# EAGLE design nanoMoCo (EAGLE 6.1)
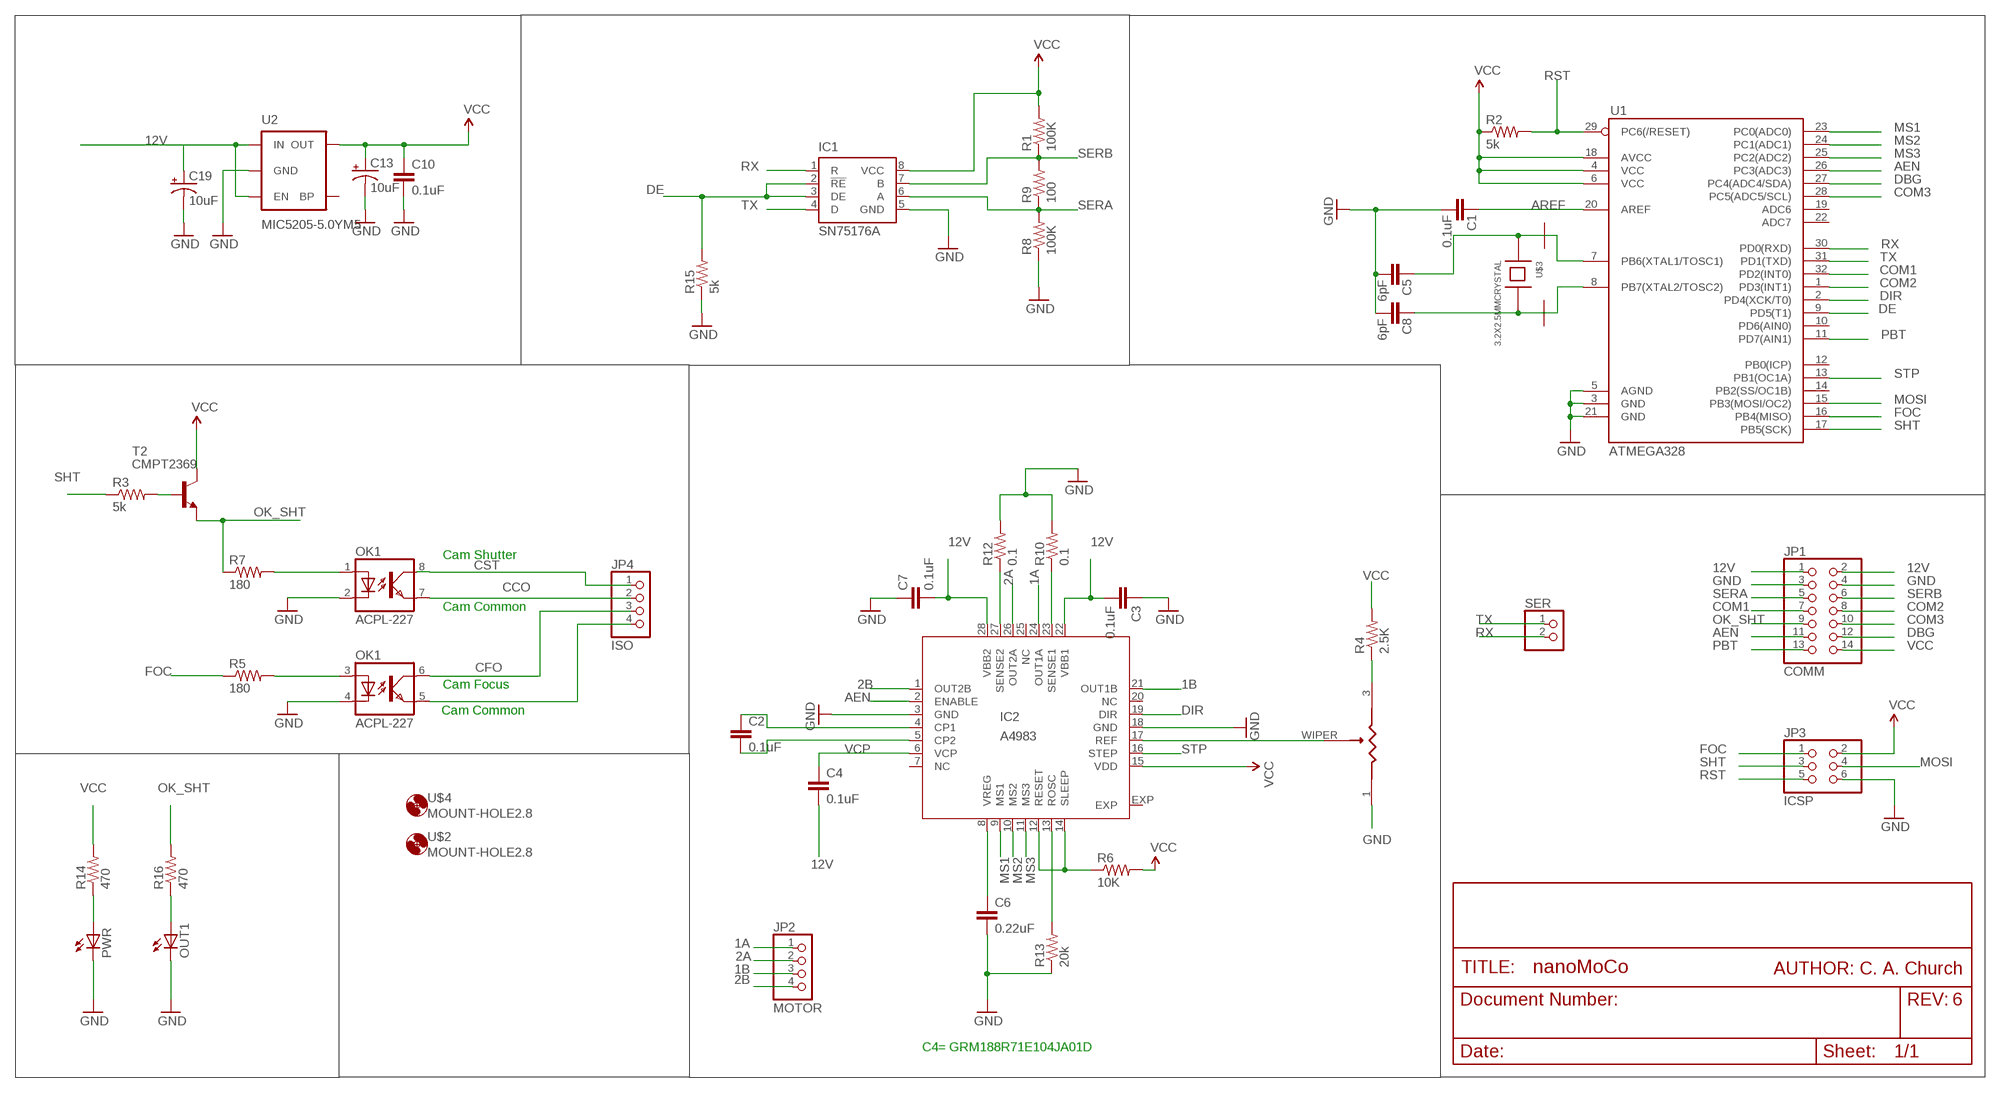
[diagram p0: schematic, sheet 1]

## Parts
C1  0.1uF  CAP0402  [C0402]
C2  0.1uF  C-EUC1608  [C1608]
C3  0.1uF  C-EUC1608  [C1608]
C4  0.1uF  C-EUC1608  [C1608]
C5  6pF  CAP0402  [C0402]
C6  0.22uF  C-EUC0805  [C0805]
C7  0.1uF  C-EUC1608  [C1608]
C8  6pF  CAP0402  [C0402]
C10  0.1uF  CAP0402  [C0402]
C13  10uF  CAP_POL1206  [EIA3216]
C19  10uF  CAP_POL1206  [EIA3216]
IC1  SN75176A  SN65176D  [SO-08]
IC2  A4983  [QFN28ET]
JP1  COMM  PINHD-2X7  [2X07]
JP2  MOTOR  PINHD-1X4  [1X04]
JP3  ICSP  PINHD-2X3  [2X03]
JP4  ISO  PINHD-1X4  [1X04]
OK1  ACPL-227  [SOIC8]
OUT1  LEDCHIPLED_0603  [CHIPLED_0603]
PWR  LEDCHIPLED_0603  [CHIPLED_0603]
R1  100K  RESISTOR0402  [C0402]
R2  5k  RESISTOR0402  [C0402]
R3  5k  RESISTOR0402  [C0402]
R4  2.5K  RESISTOR0402  [C0402]
R5  180  RESISTOR0402  [C0402]
R6  10K  RESISTOR0402  [C0402]
R7  180  RESISTOR0402  [C0402]
R8  100K  RESISTOR0402  [C0402]
R9  100  RESISTOR0402  [C0402]
R10  0.1  R-US_R0603  [R0603]
R12  0.1  R-US_R0603  [R0603]
R13  20k  RESISTOR0402  [C0402]
R14  470  RESISTOR0402  [C0402]
R15  5k  RESISTOR0402  [C0402]
R16  470  RESISTOR0402  [C0402]
SER  PINHD-1X2  [1X02]
T2  CMPT2369  BCW60-NPN-SOT23-BEC  [SOT23-BEC]
U1  ATMEGA328  ATMEGA168  [TQFP32-08]
U2  MIC5205-5.0YM5  V_REG_LDOSMD  [SOT23-5]
U$1  CADJ  TC33X-2  [3MMSMD]
U$2  MOUNT-HOLE2.8  [2,8]
U$3  3.2X2.5MMCRYSTAL  [3.2X2.5MM]
U$4  MOUNT-HOLE2.8  [2,8]

## Nets
1A: IC2.24(OUT1A) JP2.1
1B: IC2.21(OUT1B) JP2.3
2A: IC2.26(OUT2A) JP2.2
2B: IC2.1(OUT2B) JP2.4
3.3V: IC1.8(VCC) R1.2 ; supply symbol labelled VCC
12V [vcc]: C3.2 C4.2 C7.2 C19.A(+) IC2.22(VBB1) IC2.28(VBB2) JP1.1 JP1.2 U2.1(IN) U2.3(EN)
AEN: IC2.2(ENABLE) JP1.11 U1.26(PC3(ADC3))
AREF: C1.2 U1.20(AREF)
ARST: IC2.12(RESET) IC2.14(SLEEP) R6.1
CCO: JP4.2 OK1.7(EMIT)
CFO: JP4.3 OK1.6(COL1)
COM1: JP1.7 U1.32(PD2(INT0))
COM2: JP1.8 U1.1(PD3(INT1))
COM3: JP1.10 U1.28(PC5(ADC5/SCL))
CST: JP4.1 OK1.8(COL)
DBG: JP1.12 U1.27(PC4(ADC4/SDA))
DE: IC1.2(!RE) IC1.3(DE) R15.2 U1.9(PD5(T1))
DIR: IC2.19(DIR) U1.2(PD4(XCK/T0))
FOC: JP3.1 R5.1 U1.16(PB4(MISO))
GND: C1.1 C3.1 C5.1 C6.2 C7.1 C8.1 C10.2 C13.C(-) C19.C(-) IC1.5(GND) IC2.3(GND) IC2.18(GND) JP1.3 JP1.4 JP3.6 OK1.2(C) OK1.4(C1) OUT1.C PWR.C R8.1 R10.2 R12.2 R13.1 R15.1 U1.3(GND) U1.5(AGND) U1.21(GND) U2.2(GND) U$1.1
MOSI: JP3.4 U1.15(PB3(MOSI/OC2))
MS1: IC2.9(MS1) U1.23(PC0(ADC0))
MS2: IC2.10(MS2) U1.24(PC1(ADC1))
MS3: IC2.11(MS3) U1.25(PC2(ADC2))
N$1: R4.1 U$1.3
N$2: PWR.A R14.1
N$3: OUT1.A R16.1
N$4: C2.1 IC2.4(CP1)
N$5: C2.2 IC2.5(CP2)
N$6: JP4.4 OK1.5(EMIT1)
N$7: OK1.1(A) R7.2
N$8: OK1.3(A1) R5.2
N$11: IC2.17(REF) U$1.WIPER
N$14: IC2.23(SENSE1) R10.1
N$15: IC2.27(SENSE2) R12.1
N$25: R3.2 T2.B
OK_SHT: JP1.9 R7.1 R16.2 T2.E
PBT: JP1.13 U1.11(PD7(AIN1))
ROSC: IC2.13(ROSC) R13.2
RST: JP3.5 R2.2 U1.29(PC6(/RESET))
RX: IC1.1(R) SER.2 U1.30(PD0(RXD))
SERA: IC1.6(A) JP1.5 R8.2 R9.1
SERB: IC1.7(B) JP1.6 R1.1 R9.2
SHT: JP3.3 R3.1 U1.17(PB5(SCK))
STP: IC2.16(STEP) U1.13(PB1(OC1A))
TX: IC1.4(D) SER.1 U1.31(PD1(TXD))
VCC: C10.1 C13.A(+) IC2.15(VDD) JP1.14 JP3.2 R2.1 R4.2 R6.2 R14.2 T2.C U1.4(VCC) U1.6(VCC) U1.18(AVCC) U2.5(OUT)
VCP: C4.1 IC2.6(VCP)
VREG: C6.1 IC2.8(VREG)
XTAL1: C5.2 U1.7(PB6(XTAL1/TOSC1)) U$3.1
XTAL2: C8.2 U1.8(PB7(XTAL2/TOSC2)) U$3.3
Unconnected: IC2.7(NC) IC2.20(NC) IC2.25(NC) IC2.EXP U1.10(PD6(AIN0)) U1.12(PB0(ICP)) U1.14(PB2(SS/OC1B)) U1.19(ADC6) U1.22(ADC7) U2.4(BP)

## Notes on the sheet
- Cam Shutter
- Cam Common
- Cam Focus
- Cam Common
- AUTHOR: C. A. Church
- 6
- C4= GRM188R71E104JA01D

## Power pins joined to a net without a drawn wire
4: U$3.4
GND: U$3.2(GND)

## Library data of the parts
C1 C5 C8 C10 = SparkFun:CAP: Capacitor Standard 0603 ceramic capacitor, and 0.1" leaded capacitor.
C2-C4 C6 C7 = rcl:C-EU: CAPACITOR, European symbol
C13 C19 = SparkFun:CAP_POL: Capacitor Polarized These are standard SMD and PTH capacitors. Normally 10uF, 47uF, and 100uF in electrolytic and tantalum varieties. Always verify the external diameter of the through hole cap, it varies with capacity, voltage, and manufacturer. The EIA devices should be standard.
IC1 = texas:SN65176: DIFFERENTIAL BUS TRANSCEIVER Source: http://focus.ti.com .. sn65176b.pdf
IC2 = allegro:A4983: DMOS Microstepping Driver with Translator Auto generated by make-symbol-device-package-bsdl.ulp Rev. 32 Source: http://www.allegromicro.com/en/Products/Part_Numbers/4983/4983.pdf
JP1 = pinhead:PINHD-2X7: PIN HEADER
JP2 JP4 = pinhead:PINHD-1X4: PIN HEADER
JP3 = pinhead:PINHD-2X3: PIN HEADER
OK1 = avago-opto:ACPL-227: ACPL-227 Dual optocoupler SOIC8
OUT1 PWR = led:LED: LED OSRAM: - CHIPLED LG R971, LG N971, LY N971, LG Q971, LY Q971, LO R971, LY R971 LH N974, LH R974 LS Q976, LO Q976, LY Q976 LO Q996 - Hyper CHIPLED LW Q18S LB Q993, LB Q99A, LB R99A - SideLED LS A670, LO A670, LY A670, LG A670, LP A670 LB A673, LV A673, LT A673, LW A673 LH A674 LY A675 LS A676, LA A676, LO A676, LY A676, LW A676 LS A679, LY A679, LG A679 - Hyper Micro SIDELED® LS Y876, LA Y876, LO Y876, LY Y876 LT Y87S - SmartLED LW L88C, LW L88S LB L89C, LB L89S, LG L890 LS L89K, LO L89K, LY L89K LS L896, LA L896, LO L896, LY L896 - TOPLED LS T670, LO T670, LY T670, LG T670, LP T670 LSG T670, LSP T670, LSY T670, LOP T670, LYG T670 LG T671, LOG T671, LSG T671 LB T673, LV T673, LT T673, LW T673 LH T674 LS T676, LA T676, LO T676, LY T676, LB T676, LH T676, LSB T676, LW T676 LB T67C, LV T67C, LT T67C, LS T67K, LO T67K, LY T67K, LW E67C LS E67B, LA E67B, LO E67B, LY E67B, LB E67C, LV E67C, LT E67C LW T67C LS T679, LY T679, LG T679 LS T770, LO T770, LY T770, LG T770, LP T770 LB T773, LV T773, LT T773, LW T773 LH T774 LS E675, LA E675, LY E675, LS T675 LS T776, LA T776, LO T776, LY T776, LB T776 LHGB T686 LT T68C, LB T68C - Hyper Mini TOPLED® LB M676 - Mini TOPLED Santana® LG M470 LS M47K, LO M47K, LY M47K Source: http://www.osram.convergy.de LUXEON: - LUMILED® LXK2-PW12-R00, LXK2-PW12-S00, LXK2-PW14-U00, LXK2-PW14-V00 LXK2-PM12-R00, LXK2-PM12-S00, LXK2-PM14-U00 LXK2-PE12-Q00, LXK2-PE12-R00, LXK2-PE12-S00, LXK2-PE14-T00, LXK2-PE14-U00 LXK2-PB12-K00, LXK2-PB12-L00, LXK2-PB12-M00, LXK2-PB14-N00, LXK2-PB14-P00, LXK2-PB14-Q00 LXK2-PR12-L00, LXK2-PR12-M00, LXK2-PR14-Q00, LXK2-PR14-R00 LXK2-PD12-Q00, LXK2-PD12-R00, LXK2-PD12-S00 LXK2-PH12-R00, LXK2-PH12-S00 LXK2-PL12-P00, LXK2-PL12-Q00, LXK2-PL12-R00 Source: www.luxeon.com KINGBRIGHT: KA-3528ASYC Source: www.kingbright.com
R1-R9 R13-R16 = SparkFun:RESISTOR: Resistor Basic schematic elements and footprints for 0603, 1206, and PTH 1/10th watt (small) resistors.
R10 R12 = resistor:R-US_: RESISTOR, American symbol
SER = pinhead:PINHD-1X2: PIN HEADER
T2 = transistor:*-NPN-: NPN Transistror BF959 corrected 2008.03.06
U1 = SparkFun:ATMEGA168
U2 = SparkFun:V_REG_LDO: Voltage Regulator LDO Standard 150mA LDO voltage regulator in SOT-23 layout. Micrel part MIC5205. BP (by-pass) pin is used to lower output noise with 470pF cap.
U$1 = bourns trimpot:TC33X-2: Bourns TC33X-2 SMD Trimmer Potentiometer
U$2 U$4 = holes:MOUNT-HOLE: MOUNTING HOLE with drill center marker
U$3 = kyocera-crystals:3.2X2.5MMCRYSTAL: Kyocera 3.2x2.5 Mobile Crystal

## Net classes
1 vcc: width 0.254 mm

## Board
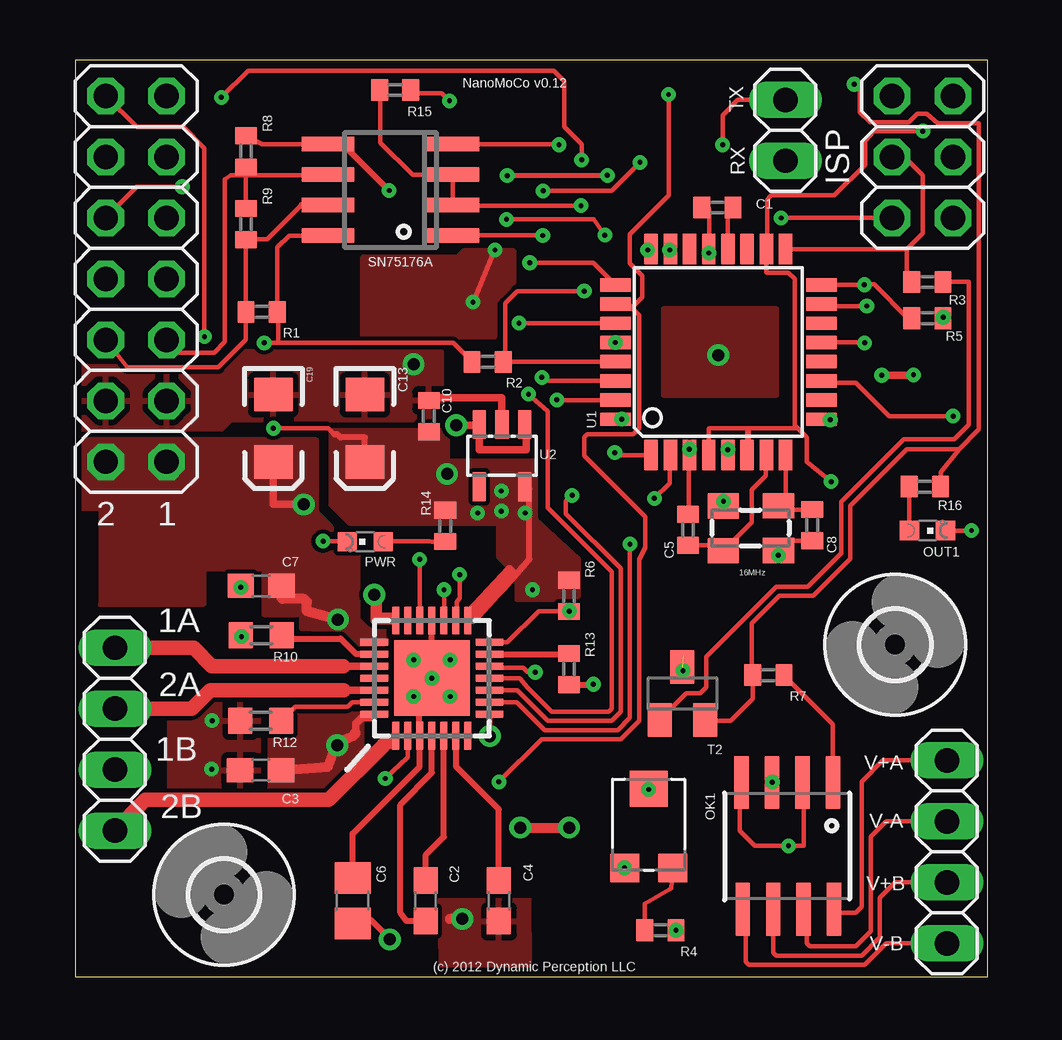
[diagram p1: board, top side]
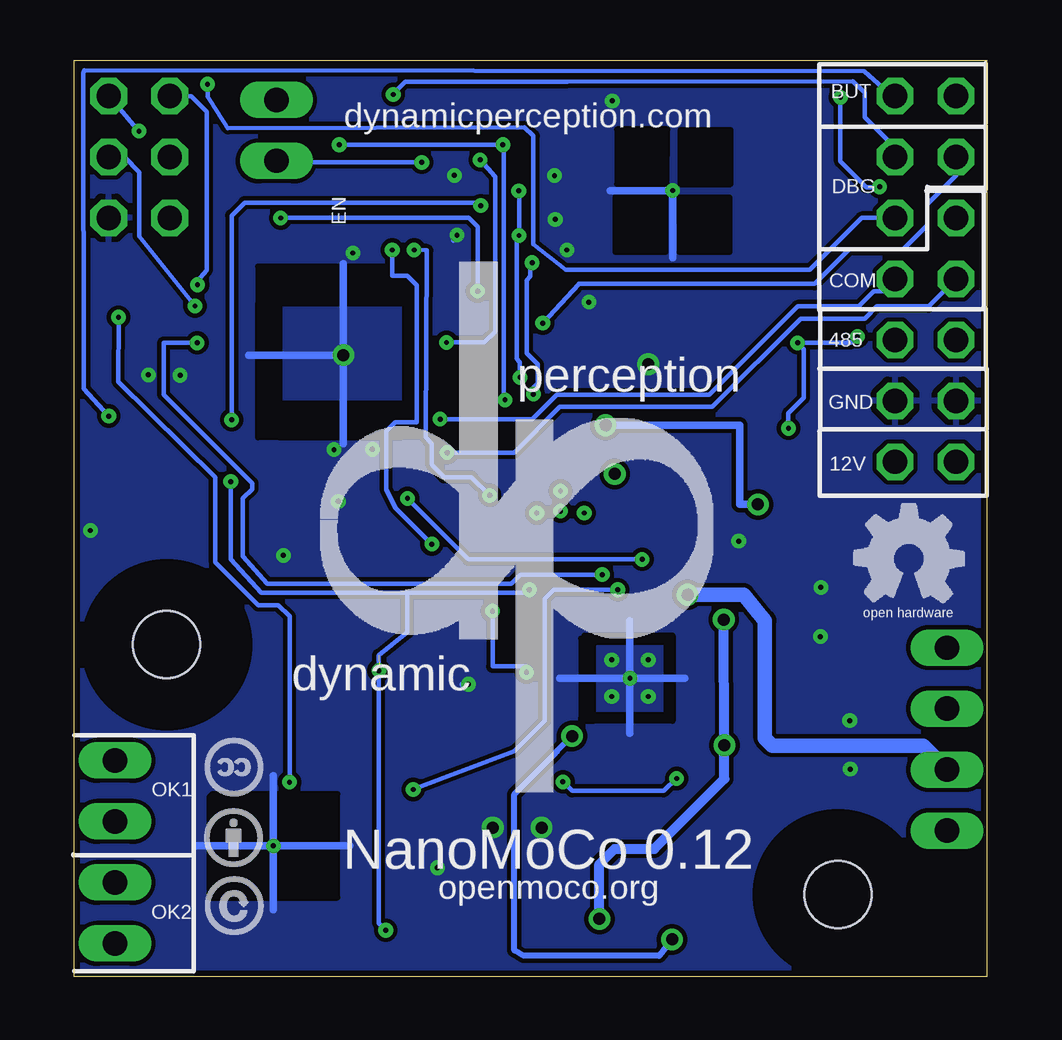
[diagram p2: board, bottom side, seen from below]

Size 38.02 x 38.2 mm. Coordinates in mm from the lower left corner, seen from the top.
Outline: 0,0 38.02,0 38.02,38.2 0,38.2 0,0
Copper layers (1*16): Top 0.035mm / dielectric 1.5mm / Bottom 0.035mm
Design rules: minimum track width 7mil, minimum drill 8mil, track to track 7mil, track to pad 7mil, pad to pad 7mil, via to via 7mil, smd to smd 7mil, copper to edge 10mil, drill to drill 8mil, minimum pad ring 10mil, minimum via ring 8mil, stop-mask expansion 4mil, vias tented up to drill 25mil, thermal gap 10mil
bRestrict: area 13.1,10.8 to 13.3,14.2; area 13.5,14 to 16.8,14.2; area 16.4,10.7 to 16.9,14.1; area 13.1,10.7 to 16.4,10.9; area 23.2,22.5 to 24.3,29.6; area 24.3,28.1 to 30.4,29.6; area 29.5,22.5 to 30.4,27.9; area 24.4,22.5 to 29.3,23.9; area 27.1,3.3 to 32.4,7.6; area 10.7,33 to 12.8,35.3; area 13.3,33 to 15.4,35.3; area 10.7,30.2 to 12.8,32.5; 1 more areas

### Footprints (pad centres in the part's own frame; a part is rotated, then mirrored left to right if it is on the bottom)
C0402 = smd 0.7 x 0.9: 1 -0.65,0; 2 0.65,0
C1608 = smd 1.1 x 1: 1 -0.85,0; 2 0.85,0
C0805 = smd 1.3 x 1.5: 1 -0.95,0; 2 0.95,0
EIA3216 = smd 1.4 x 1.6: A 1.4,0; C -1.4,0
SO-08 = smd 0.6 x 2.2: 1 -1.905,-2.6; 2 -0.635,-2.6; 3 0.635,-2.6; 4 1.905,-2.6; 5 1.905,2.6; 6 0.635,2.6; 7 -0.635,2.6; 8 -1.905,2.6
QFN28ET = smd 1.15 x 0.3: 1 -2.4,1.5; 2 -2.4,1; 3 -2.4,0.5; 4 -2.4,0; 5 -2.4,-0.5; 6 -2.4,-1; 7 -2.4,-1.5; 15 2.4,-1.5; 16 2.4,-1; 17 2.4,-0.5; 18 2.4,0; 19 2.4,0.5; 20 2.4,1; 21 2.4,1.5 | smd 0.3 x 1.15: 8 -1.5,-2.4; 9 -1,-2.4; 10 -0.5,-2.4; 11 0,-2.4; 12 0.5,-2.4; 13 1,-2.4; 14 1.5,-2.4; 22 1.5,2.4; 23 1,2.4; 24 0.5,2.4; 25 0,2.4; 26 -0.5,2.4; 27 -1,2.4; 28 -1.5,2.4 | smd 3.15 x 3.15: EXP 0,0
2X07 = drill 1.016 octagon: 1 -7.62,-1.27; 2 -7.62,1.27; 3 -5.08,-1.27; 4 -5.08,1.27; 5 -2.54,-1.27; 6 -2.54,1.27; 7 0,-1.27; 8 0,1.27; 9 2.54,-1.27; 10 2.54,1.27; 11 5.08,-1.27; 12 5.08,1.27; 13 7.62,-1.27; 14 7.62,1.27
1X04 = drill 1.016 long: 1 -3.81,0; 2 -1.27,0; 3 1.27,0; 4 3.81,0
2X03 = drill 1.016 octagon: 1 -2.54,-1.27; 2 -2.54,1.27; 3 0,-1.27; 4 0,1.27; 5 2.54,-1.27; 6 2.54,1.27
SOIC8 = smd 2.2 x 0.6: 1 0,3.81; 2 0,2.54; 3 0,1.27; 4 0,0; 5 5.28,0.05; 6 5.28,1.32; 7 5.28,2.59; 8 5.28,3.86
CHIPLED_0603 = smd 0.8 x 0.8: A 0,-0.75; C 0,0.75
R0603 = smd 1 x 1.1: 1 -0.85,0; 2 0.85,0
1X02 = drill 1.016 long: 1 -1.27,0; 2 1.27,0
SOT23-BEC = smd 1 x 1.4: B -0.95,-1.1; C 0,1.1; E 0.95,-1.1
TQFP32-08 = smd 1.27 x 0.559: 1 -4.293,2.8; 2 -4.293,2; 3 -4.293,1.2; 4 -4.293,0.4; 5 -4.293,-0.4; 6 -4.293,-1.2; 7 -4.293,-2; 8 -4.293,-2.8; 17 4.293,-2.8; 18 4.293,-2; 19 4.293,-1.2; 20 4.293,-0.4; 21 4.293,0.4; 22 4.293,1.2; 23 4.293,2; 24 4.293,2.8 | smd 0.559 x 1.27: 9 -2.8,-4.293; 10 -2,-4.293; 11 -1.2,-4.293; 12 -0.4,-4.293; 13 0.4,-4.293; 14 1.2,-4.293; 15 2,-4.293; 16 2.8,-4.293; 25 2.8,4.293; 26 2,4.293; 27 1.2,4.293; 28 0.4,4.293; 29 -0.4,4.293; 30 -1.2,4.293; 31 -2,4.293; 32 -2.8,4.293
SOT23-5 = smd 0.55 x 1.2: 1 -0.95,-1.3; 2 0,-1.3; 3 0.95,-1.3; 4 0.95,1.3; 5 -0.95,1.3
3MMSMD = smd 1.2 x 1.2: 1 -0.6,0.6; 3 1.4,0.6 | smd 1.6 x 1.5: WIPER 0.4,3.9
2,8 = hole 2.8: 0,0
3.2X2.5MM = smd 1.3 x 1.05: 1 0.635,0; 2 2.935,0.01; 3 2.935,1.875; 4 0.635,1.865

### Placement (x,y rotation side)
C1  26.76,32.05 0 top
C2  14.61,3.17 90 top
C3  7.72,8.62 0 top
C4  17.65,3.17 270 top
C5  25.53,18.63 270 top
C6  11.56,3.17 90 top
C7  7.75,16.29 0 top
C8  30.71,18.82 90 top
C10  14.73,23.37 90 top
C13  12.06,22.86 270 top
C19  8.26,22.86 270 top
IC1  13.13,32.79 90 top
IC2  14.86,12.45 90 top
JP1  2.54,29.08 90 top
JP2  1.65,9.91 270 top
JP3  35.31,34.16 270 top
JP4  36.32,5.21 270 top
OK1  27.76,8.1 270 top
OUT1  35.51,18.6 270 top
PWR  12.08,18.14 90 top
R1  7.77,27.71 0 top
R2  17.18,25.63 0 top
R3  35.51,28.96 0 top
R4  24.38,1.94 0 top
R5  35.51,27.44 0 top
R6  20.57,15.88 90 top
R7  28.88,12.57 0 top
R8  7.11,34.4 270 top
R9  7.11,31.37 270 top
R10  7.75,14.24 180 top
R12  7.73,10.67 180 top
R13  20.57,12.83 90 top
R14  15.42,18.79 90 top
R15  13.34,36.96 180 top
R16  35.4,20.43 0 top
SER  29.59,35.27 270 top
T2  25.3,11.81 0 top
U1  26.8,26.04 90 top
U2  17.78,21.72 180 top
U$1  23.5,3.94 0 top
U$2  6.2,3.43 270 top
U$3  26.37,17.75 0 top
U$4  34.16,13.84 0 top

### Tracks (layer width: path | path; a pad name or v marks a point on that pad's centre or on a via)
1A
  Top 0.305: 11.18,12.95 IC2.24
  Top 0.61: 11.18,12.95 5.69,12.95 4.93,13.72 JP2.1
1B  (via drill 0.5 pad 0.25)
  Top 0.305: IC2.21 12.46,14.85 v12.46,15.93
  Bottom 0.61: v12.46,15.93 10.12,15.93 9.24,14.84 9.24,9.95 8.92,9.63 2.65,9.63 JP2.3
2A
  Top 0.305: IC2.26 11.18,11.95 10.66,11.95
  Top 0.61: JP2.2 4.86,11.18 5.63,11.94 11.18,11.94 11.18,11.95
2B
  Top 0.25: 13.33,9.79 13.33,10.02 IC2.1
  Top 0.305: IC2.1 13.36,9.68 13.34,9.65 12.83,9.65 | 12.79,9.79 13.33,9.79 13.33,9.8
  Top 0.61: 12.83,9.65 12.83,9.64 10.56,7.37 2.93,7.37 JP2.4
3.3V
  Top 0.178: IC1.8 8.91,30.89 8.43,30.4 8.43,27.72
  Top 0.254: 8.43,27.72 R1.2
12V  (via drill 0.5 pad 0.25)
  Top 0.305: U2.1 18.8,23.02 18.8,21.97 16.83,21.97 U2.3 16.83,22.99 v15.88,22.99 | C19.A 8.26,19.68 v9.53,19.68 | 11.68,10.17 11.68,10.54 11.94,10.79 12.31,10.79 IC2.28 | v10.95,14.89 v10.95,14.9
  Top 0.406: C7.2 8.6,15.79 8.64,15.75 9.53,15.75 9.65,15.62 9.65,15.24 v10.95,14.89 | 11.56,10.03 10.92,9.78 10.54,8.76 C3.2 | 11.56,10.03 11.56,10.04 | 11.56,10.03 11.57,10.03 11.68,10.17 | v16.13,2.41 15.62,2.41
  Bottom 0.305: v9.53,19.68 10.29,19.68 10.29,22.99 v15.88,22.99
  Bottom 0.406: v10.95,14.89 v10.92,9.65 10.92,8.26 13.84,5.33 15.49,5.33 16.13,4.7 v16.13,2.41
  pour Top (isolate 0.178, no thermals): 0,22.23 0,19.56 7.75,19.56 7.87,19.43 7.87,15.11 9.27,15.11 10.03,15.88 10.03,22.35 0.13,22.35
  pour Top: 15.21,3.2 15.24,0.51 18.91,0.53 18.9,3.17 15.44,3.15 15.29,3.17
  pour Top (no thermals): 8.13,10.92 8.13,7.49 10.54,7.49 11.94,8.89 11.94,10.92
  pour Top (no thermals): 9.41,15.11 9.41,14.52 9.42,14.5 9.86,14.5 10.5,13.86 12.88,13.86 12.88,14.49 12.87,14.5 12.19,14.5 11.8,14.9 11.8,17.61 9.54,19.88 9.54,15.24
  pour Top (no thermals): 1.07,19.55 1.07,15.54 1.03,15.51 5.33,15.51 5.37,15.54 5.37,16.95 5.33,16.99 7.89,16.99 7.92,17.03 7.92,19.55 7.89,19.58 1.1,19.58
AEN  (via drill 0.2, 0.2 pad 0.25)
  Top 0.178: IC2.2 13.86,9.16 v12.92,8.27 | v17.65,8.13 19.43,9.91 22.73,9.91 23.5,10.67 23.5,17.39 23.75,17.91 23.75,19.18 21.21,21.72 21.21,22.48 21.34,22.61 23.24,22.61 23.5,22.86 23.5,27.56 23.18,27.88 23.62,28.32 23.62,29.22 23.1,29.74 23.1,30.94 24.72,32.56 v24.72,36.77
  Top 0.254: 23.18,27.88 23.02,28.04 | 23.02,28.04 U1.26 | 23.02,28.04 22.92,27.94 22.86,27.94
  Bottom 0.178: v12.92,8.27 13.46,7.75 17.27,7.75 v17.65,8.13 | JP1.11 3.81,34.54 5.08,35.81 5.08,36.83 5.58,37.33 17.45,37.3 19.48,37.3 19.49,37.31 24.23,37.31 24.73,36.8 v24.72,36.77
AREF
  Top 0.178: U1.20 27.2,32.02 27.43,32.26 27.39,32.19
  Top 0.254: 27.39,32.19 C1.2
ARST  (via drill 0.2 pad 0.18)
  Top 0.178: IC2.14 18.01,13.95 19.3,15.24 20.3,15.24 | R6.1 v20.59,15.24 | IC2.12 17.33,12.88 18.67,12.88 18.86,12.69 v19.17,12.69
  Top 0.254: 20.3,15.24 R6.1 v20.59,15.24
  Bottom 0.178: v20.59,15.24 20.59,12.94 19.18,12.95 v19.17,12.69
CCO
  Top 0.178: 30.48,2.69 30.48,1.4 30.61,1.27 32.51,1.27 33.15,1.91 33.15,5.84 33.78,6.48 JP4.2
  Top 0.254: OK1.7 30.48,2.69
CFO
  Top 0.178: OK1.6 29.08,1.02 29.21,0.89 32.77,0.89 33.53,1.65 33.53,3.3 34.16,3.94 JP4.3
  Top 0.254: OK1.6
COM1  (via drill 0.2 pad 0.25)
  Top 0.178: v22.77,23.24 22.56,23.22 U1.32
  Bottom 0.178: JP1.7 4.32,28.57 4.7,28.57 5.33,27.94 7.87,27.94 11.56,24.26 17.91,24.26 18.92,23.24 v22.77,23.24
COM2  (via drill 0.2 pad 0.25)
  Top 0.178: v22.48,21.84 22.58,21.74 U1.1
  Bottom 0.178: JP1.8 2.41,27.94 4.57,27.94 5.08,27.43 7.75,27.43 11.43,23.75 17.78,23.75 19.68,21.84 v22.48,21.84
COM3  (via drill 0.2)
  Top 0.178: v21.1,34.04 21.1,34.69 20.37,35.42 20.37,37.33 19.93,37.76 7.21,37.76 v6.09,36.65 | JP1.10 2.57,32.92 3.47,32.92 v4.46,32.92 | U1.28
  Bottom 0.178: U1.28 20.92,26.43 20.47,26.89 20.47,33.33 v21.1,34.04 | v6.09,36.65 6.09,33.98 5.02,32.91 4.48,32.91 v4.46,32.92
  other vias: 22.5,26.44
CST
  Top 0.178: 31.78,2.67 32.51,2.67 32.77,2.92 32.77,8.13 33.66,9.02 JP4.1
  Top 0.254: OK1.8 31.78,2.67
DBG  (via drill 0.2 pad 0.18)
  Top 0.178: v18.49,27.24 U1.27
  Bottom 0.178: JP1.12 1.27,33.4 2.48,32.19 2.48,31.32 3.47,30.33 5.71,30.33 7.16,28.88 16.99,28.88 16.99,28.85 v18.49,27.24
DE  (via drill 0.2)
  Top 0.178: 12.72,36.96 12.72,34.77 14.06,33.42 IC1.3 IC1.2 15.75,32.14 v21.08,32.14 | U1.9 31.43,23.23 v31.46,23.21
  Top 0.406: 12.72,36.96 R15.2
  Bottom 0.178: v31.46,23.21 31.46,31.72 30.91,32.26 21.2,32.26 v21.08,32.14
DIR  (via drill 0.2 pad 0.25)
  Top 0.178: IC2.19 14.36,16.64 14.35,17.32 v14.35,17.4 | v24.13,19.94 24.77,20.57 24.77,21.71
  Top 0.254: 24.77,21.71 U1.2
  Bottom 0.178: v14.35,17.4 21.59,17.4 v24.13,19.94
FOC  (via drill 0.2 pad 0.25)
  Top 0.178: U1.16 32.51,28.84 v32.88,28.84 32.89,28.85 33.3,28.85 34.7,27.45 R5.1
  Bottom 0.178: JP3.1 33.15,36.7 32.5,36.05 32.5,29.45 32.88,28.99 v32.88,28.84
GND  (via drill 0.2, 0.2 pad 0.18, 0.2 pad 0.23, 0.2 pad 0.25, 0.5 pad 0.25)
  Top 0.178: IC1.5 7.79,34.7 R8.1 | C1.1 26.15,32.27 26.42,32 26.42,30.35 26.43,30.25 v26.4,30.16 | v25.59,21.98 25.6,21.96 U1.3 25.57,21.71 25.57,19.32 C5.1 | R15.1 13.98,36.87 13.98,36.82 15.28,36.82 v15.6,36.5 | 27.69,8.03 27.69,6.1 28.32,5.46 v29.72,5.46 30.35,5.46 30.35,8.05 | U1.5 27.18,21.95 v27.19,21.97 | C8.1 29.71,18.17 U$3.2 v29.3,17.56 | v16.57,28.12 v17.49,30.29 | v18,33.39 22.04,33.38 v22.17,33.4 v17.99,33.4 17.97,33.38 17.97,33.4 17.98,33.41 | 17.97,31.52 v17.97,31.57 21.61,31.56 v22.07,30.91 | OUT1.C v37.34,18.6 | v10.33,18.16 PWR.C
  Top 0.254: U1.5 27.18,21.72 | U1.21 26.42,30.35 | C6.2 11.56,5.97 14.35,8.76 14.35,10.04 IC2.3 14.34,10.05 14.34,11.2 14.1,11.2 v14.1,11.68 | R13.1 21.57,12.18 v21.59,12.19 | IC1.5 11.15,34.7 v13.08,32.77 | v14.86,12.45 IC2.18 | 27.69,8.03 OK1.4 | 30.35,8.05 OK1.2 | v22.89,4.55 U$1.1 | C7.1 v6.9,16.23 | R10.2 v6.93,14.18
  Top 0.305: U2.2 17.78,24.13 14.73,24.13 C10.2 | v33.6,25.07 v34.91,25.07 v34.92,25.08
  Top 0.406: v18.54,6.22 v20.57,6.22
  Bottom 0.178: v22.07,30.91 22.07,30.82 22.21,30.67
  Bottom 0.254: v21.59,12.19 21.84,12.19
  Bottom 0.305: v14.86,12.45 IC2.18 | v14.86,12.45 17.78,12.45 | v14.86,12.45 14.86,10.16 | 12.57,12.45 v14.86,12.45 | v26.8,25.91 26.8,29.72 | v26.8,25.91 30.73,25.91 | 26.8,22.23 v26.8,25.91 | 15.68,32.77 v13.08,32.77 13.08,29.97 | v29.72,5.46 32.89,5.46 | v29.72,5.46 29.72,8.38 | v29.72,5.46 26.54,5.46 | 29.72,2.79 v29.72,5.46
  other vias: 14.1,13.21 15.62,13.21 15.62,11.68 5.68,8.65 14.1,25.53 5.7,10.68 27.01,19.81
  pour Top: 24.51,27.81 24.51,24.26 29.21,24.26 29.21,27.81
  pour Top (isolate 0.178): 0,25.27 0,22.86 6.1,22.86 6.48,23.24 15.24,23.24 15.24,26.04 5.59,26.04 4.95,25.4 0.13,25.4
  pour Bottom: 0,25.02 5.71,25.02 5.84,20.07 5.84,19.94 7.49,18.29 7.49,15.62 0.13,15.62 0.13,24.89
  pour Top: 7.62,12.06 5.33,12.06 3.94,10.67 3.94,6.48 7.62,6.48
  pour Bottom: 0,38.1 37.97,38.1 37.97,0.13 37.85,0 0,0
  pour Bottom (no thermals): 13.46,13.84 13.46,11.05 16.26,11.05 16.26,13.84
  pour Bottom (no thermals): 24.51,27.81 24.51,24.13 29.21,24.13 29.21,27.81
  pour Top: 16.27,30.25 18.25,30.25 18.25,29.6 18.25,28.92 17.45,28.12 17.45,26.67 12,26.67 12,29.98 15.96,29.98 16.23,30.25
MOSI  (via drill 0.2 pad 0.25)
  Top 0.178: 31.18,27.94 v32.98,27.95
  Top 0.254: U1.15 31.18,27.94
  Bottom 0.178: v32.98,27.95 35.31,30.86 35.31,33.53 35.94,34.16 JP3.4
MS1  (via drill 0.2 pad 0.25)
  Top 0.178: IC2.9 18.4,11.45 19.56,10.29 22.61,10.29 23.11,10.79 v23.11,18.03 | v24.77,30.29 24.84,30.31 U1.23
  Bottom 0.178: v23.11,18.03 24.64,19.56 25.02,20.32 25.02,22.73 24.64,23.11 23.75,23.11 23.75,28.83 24.13,29.21 24.77,29.21 v24.77,30.29
MS2  (via drill 0.2 pad 0.23, 0.2 pad 0.25)
  Top 0.178: IC2.10 18.41,11.95 19.68,10.67 22.35,10.67 22.73,11.05 22.73,17.02 20.45,19.3 20.45,19.81 v20.7,20.07 | v23.85,30.29 23.98,30.3 U1.24
  Bottom 0.178: v23.85,30.29 23.32,30.28 23.37,22.48 23.11,22.23 23.11,21.34 22.61,20.83 21.46,20.83 v20.7,20.07
MS3  (via drill 0.2 pad 0.18)
  Top 0.178: IC2.11 18.52,12.45 18.86,12.05 19.85,11.05 22.23,11.05 22.35,11.18 22.35,16.89 19.68,19.56 19.68,23.56 v18.89,24.28 | v18.94,29.76 21.58,29.76 U1.25
  Bottom 0.178: 18.92,29.74 v18.94,29.76 19.01,29.68 19.01,29.18 19.16,29.03 19.16,25.98 18.71,25.53 18.71,24.73 18.89,24.55 v18.89,24.28
N$1
  Top 0.178: R4.1 23.74,3.05 24.77,3.66 24.84,3.7 U$1.3
N$2
  Top 0.178: R14.1 14.85,18.14 14.77,18.14 12.94,18.14 PWR.A
N$3
  Top 0.178: OUT1.A 34.76,20.32 R16.1
N$4
  Top 0.254: C2.1 13.8,2.33 13.55,2.68 13.55,7.16 14.86,8.51 IC2.4
N$5
  Top 0.254: IC2.5 15.36,5.83 14.61,5.08 C2.2
N$6
  Top 0.178: 27.94,2.69 27.94,0.64 28.07,0.51 32.89,0.51 33.78,1.4 JP4.4
  Top 0.254: OK1.5 27.94,2.69
N$7
  Top 0.178: R7.2 31.57,10.53 OK1.1
  Top 0.254: OK1.1 31.6,8.13
N$8  (via drill 0.2 pad 0.18, 0.2 pad 0.25)
  Top 0.178: v36.17,27.48 R5.2
  Top 0.254: R5.2 | OK1.3 v29.05,8.12 29.08,8.15
  Bottom 0.178: v36.17,27.48 36.18,24.8 32.13,20.83 32.13,17.27 30.35,15.49 29.52,15.49 29.05,15.02 v29.05,8.12
N$9  (via drill 0.2 pad 0.18)
  other vias: 25.32,12.76
N$11  (via drill 0.2 pad 0.25)
  Top 0.178: U$1.WIPER v23.9,7.81 v23.89,7.81 | v15.37,16.13 IC2.17
  Top 0.254: IC2.17
  Bottom 0.178: v23.89,7.81 19.68,9.4 18.41,10.67 18.41,15.75 18.03,16.13 v15.37,16.13
N$12
  Top 0.25: 12.64,15.93 12.66,15.93 12.66,15.05 12.72,15.05 12.72,15.06 13.34,15.06 13.34,15.11
N$14
  Top 0.254: IC2.23 12.44,13.46 11.7,13.46 11.06,14.1 8.74,14.1 R10.1
N$15
  Top 0.178: IC2.27 11.54,11.45 11.35,11.26 9.16,11.26 R12.1
  Top 0.254: IC2.27 12.44,11.43
N$25
  Top 0.178: R3.2 36.2,28.96 | T2.B 25.45,11.81 26.04,11.81 26.29,12.06 26.29,13.34 29.21,16.26 30.52,16.26 31.91,17.65 31.91,19.8 32.37,20.25 34.52,22.4 36.62,22.4 37.22,23 37.22,28.96 R3.2 | R3.2 36.17,28.97 36.18,28.97
OK_SHT  (via drill 0.2)
  Top 0.178: 28.19,12.61 28.19,14.73 29.34,15.88 30.75,15.88 32.29,17.42 32.29,19.64 34.64,21.99 36.84,21.99 | 26.29,10.67 27.3,10.67 28.23,11.59 R7.1 | v32.46,37.19 32.7,36.96 32.7,36.04 33.12,35.61 34.73,35.61 35.08,35.97 35.48,35.97 35.93,35.56 37.64,35.56 37.66,22.81 36.84,21.99 | 36.84,21.99 36.05,21.03 R16.2
  Top 0.254: 28.19,12.61 R7.1 | 26.29,10.67 T2.E
  Bottom 0.178: JP1.9 5.21,31.62 7.37,29.46 17.53,29.46 18.89,30.53 18.89,35.05 19.27,35.4 31.61,35.36 32.46,36.66 v32.46,37.19
PBT  (via drill 0.2 pad 0.25)
  Top 0.178: 31.16,24.77 32.51,24.77 33.91,23.37 v36.58,23.37
  Top 0.254: 31.16,24.77 U1.11
  Bottom 0.178: v36.58,23.37 37.62,24.5 37.63,37.64 37.59,37.77 5.11,37.74 3.94,36.7
  Bottom 0.254: JP1.13 3.94,36.7
ROSC
  Top 0.254: IC2.13 20.29,13.45 R13.2
RST  (via drill 0.2 pad 0.18, 0.2 pad 0.25)
  Top 0.178: v21.21,28.57 18.41,28.57 17.91,28.07 17.91,25.7 R2.2 | R2.2 17.83,25.83 17.92,25.92 | v29.41,31.62 JP3.5 | U1.29 R2.2
  Bottom 0.178: v29.41,31.62 21.58,31.62 21.21,31.25 v21.21,28.57
RX  (via drill 0.2, 0.2 pad 0.25)
  Top 0.178: v19.44,24.98 19.74,24.84 U1.30 | IC1.1 16.1,30.89 16.12,30.9 19.45,30.9 v19.48,30.89 | v19.5,32.75 22.35,32.75 v23.53,33.94
  Bottom 0.178: v19.44,24.98 19.44,25.62 19.58,25.76 19.58,30.79 v19.48,30.89 v19.48,32.76 v19.5,32.75 | v23.53,33.94 29.53,33.94 SER.2
SERA
  Top 0.178: 6.48,33.4 7.11,33.4 | 7.11,33.4 10.51,33.4 | 6.48,33.4 7.12,33.4 R8.2 | 7.11,33.4 R9.1 | 6.48,33.4 6.24,33.23 6.24,26.46 5.79,26.01 4.34,26.01 JP1.5
  Top 0.254: 10.51,33.4 IC1.6
SERB
  Top 0.178: 7.11,28.57 7.11,26.54 5.97,25.4 2.16,25.4 JP1.6 | 7.11,28.57 R1.1 | 7.11,28.57 R9.2 | 9.42,32.16 8,30.73 7.13,30.73
  Top 0.254: 9.42,32.16 IC1.7 | R9.2 7.13,30.73
SHT
  Top 0.178: JP3.3 34.54,34.16 35.31,33.4 35.31,30.99 34.65,30.33 | U1.17 34.65,30.33 | 34.65,30.33 34.65,29.45 R3.1
STP  (via drill 0.2 pad 0.25)
  Top 0.178: 32.87,26.43 U1.13 | v16.02,16.76 16.03,16.13 16.03,15.77 15.89,15.63 15.89,14.88 IC2.16
  Top 0.254: v32.89,26.42 32.87,26.43
  Bottom 0.178: v32.89,26.42 34.29,26.42 34.29,24.26 30.61,20.57 30.61,20.32 30.99,19.94 30.99,17.53 29.97,16.38 19.81,16.38 19.43,16.76 v16.02,16.76
TX  (via drill 0.2, 0.2 pad 0.25)
  Top 0.178: v20.07,24.04 20.41,24.04 U1.31 | IC1.4 20.13,34.7 v20.16,34.67 | v26.98,34.67 26.98,35.9 27.61,36.54 SER.1
  Bottom 0.178: v20.07,24.04 20.12,24 20.12,34.63 v20.16,34.67 v26.98,34.67 26.98,34.7
VCC  (via drill 0.2, 0.2 pad 0.18, 0.2 pad 0.23, 0.2 pad 0.25, 0.5 pad 0.25)  (1 unrouted)
  Top 0.178: v31.5,20.63 v31.5,20.64 30.48,21.46 30.48,22.48 30.1,22.86 | v8.26,22.86 10.54,22.86 10.79,22.61 | 28.07,22.86 28,22.79 U1.6 | 28.07,22.86 28.07,21.81 | 28.07,22.86 26.42,22.86 26.4,22.84 U1.4 | 30.1,22.86 28.07,22.86 | 30.1,22.86 29.97,22.99 29.97,29.08 29.72,29.34 28.83,29.34 28.8,29.37 U1.18 | 28.83,30.36 28.84,30.37 28.84,32.38 28.9,32.46 28.99,32.58 31.62,32.58 32.92,33.83 32.92,34.85 33.26,35.24 v35.32,35.24 | v5.38,26.68 5.38,34.52 4.5,35.41 2.56,35.41 JP1.14 | 8.41,27.71 8.38,27.71 8.45,27.64 8.45,26.42 | R2.1 15.75,26.42 8.45,26.42 | v7.87,26.42 8.45,26.42 | 16.48,14.95 16.46,14.95 IC2.15
  Top 0.254: 18.8,20.45 18.92,20.32 18.92,17.41 17.87,16.2 17.6,15.91 16.62,14.85 IC2.15 | U1.18 28.83,30.36 | 10.79,22.61 10.92,22.61 11.05,22.48 12.06,22.48 C13.A | 28.07,21.81 U1.6 | R2.1 16.53,25.72
  Top 0.305: 16.48,14.95 18.24,16.87 18.08,17 16.4,15.19
  Top 0.406: 8.41,27.71
  Bottom 0.178: v31.5,20.64 31.5,17.4 30.23,16 24.13,16 | 24.13,16 19.18,16 | v8.26,22.86 8.26,23.5 7.62,24.13 7.62,26.16 v7.87,26.42 5.67,26.42 5.64,26.45 5.61,26.45 v5.38,26.68 | 24.13,16 24.13,14.35 25.34,13.41 25.34,2.25 R4.2 | v35.32,35.24 36.55,36.7 JP3.2
  Bottom 0.254: 19.18,16 v19.05,16.13
  other vias: 15.49,20.95 17.75,20.24 17.75,19.41 18.75,19.33 16.76,19.33 25.03,1.94
  pour Top (no thermals): 10.67,22.73 10.67,19.68 11.43,18.92 19.18,18.92 19.18,21.46 15.49,21.46 15.49,22.73
  pour Top (no thermals): 17.65,21.46 17.65,17.53 18.41,16.76 18.41,15.75 20.07,15.75 20.19,15.88 20.95,15.88 20.95,17.4 19.18,19.05 19.18,21.46
VCP
  Top 0.254: C4.1 17.65,6.99 15.88,8.76 15.88,10.03 IC2.6
VREG  (via drill 0.5 pad 0.23, 0.5 pad 0.25)
  Top 0.254: v17.27,10.03 17.27,10.93 IC2.8 | C6.1 11.59,2.36 12.33,2.36 12.81,1.88 v13.11,1.56
  Bottom 0.254: v17.27,10.03 17.91,9.4 18.02,9.27 19.67,7.62 19.67,1.1 19.3,0.89 13.64,0.88 v13.11,1.56
XTAL1
  Top 0.178: U$3.1 27.16,17.75 27.16,17.79 | U$3.1 | U1.7 28.77,21.71 28.77,20.88 28.19,20.31 28.19,18.95 U$3.1 | C5.2 26.77,17.98 U$3.1
  Top 0.254: U1.7 28.83,21.71
XTAL2
  Top 0.178: U1.8 29.6,19.93 U$3.3 29.46,19.47 C8.2

### Text on the board
tNames: NanoMoCo v0.12 | TX | RX | ISP | SN75176A | 2 | 1 | 16MHz | 1A | 2A | 1B | V+A | 2B | V-A | V+B | V-B | (c) 2012 Dynamic Perception LLC
bNames: BUT | dynamicperception.com | DBG | EN | COM | 485 | GND | perception | 12V | open hardware | dynamic | OK1 | NanoMoCo 0.12 | openmoco.org | F:/by.large copy.bmp | F:/cc.large copy.bmp | F:/sa.large copy.bmp | OK2